# EAGLE design charger-sw (EAGLE 5.12)
PARTNO: MMBT3906LT1G
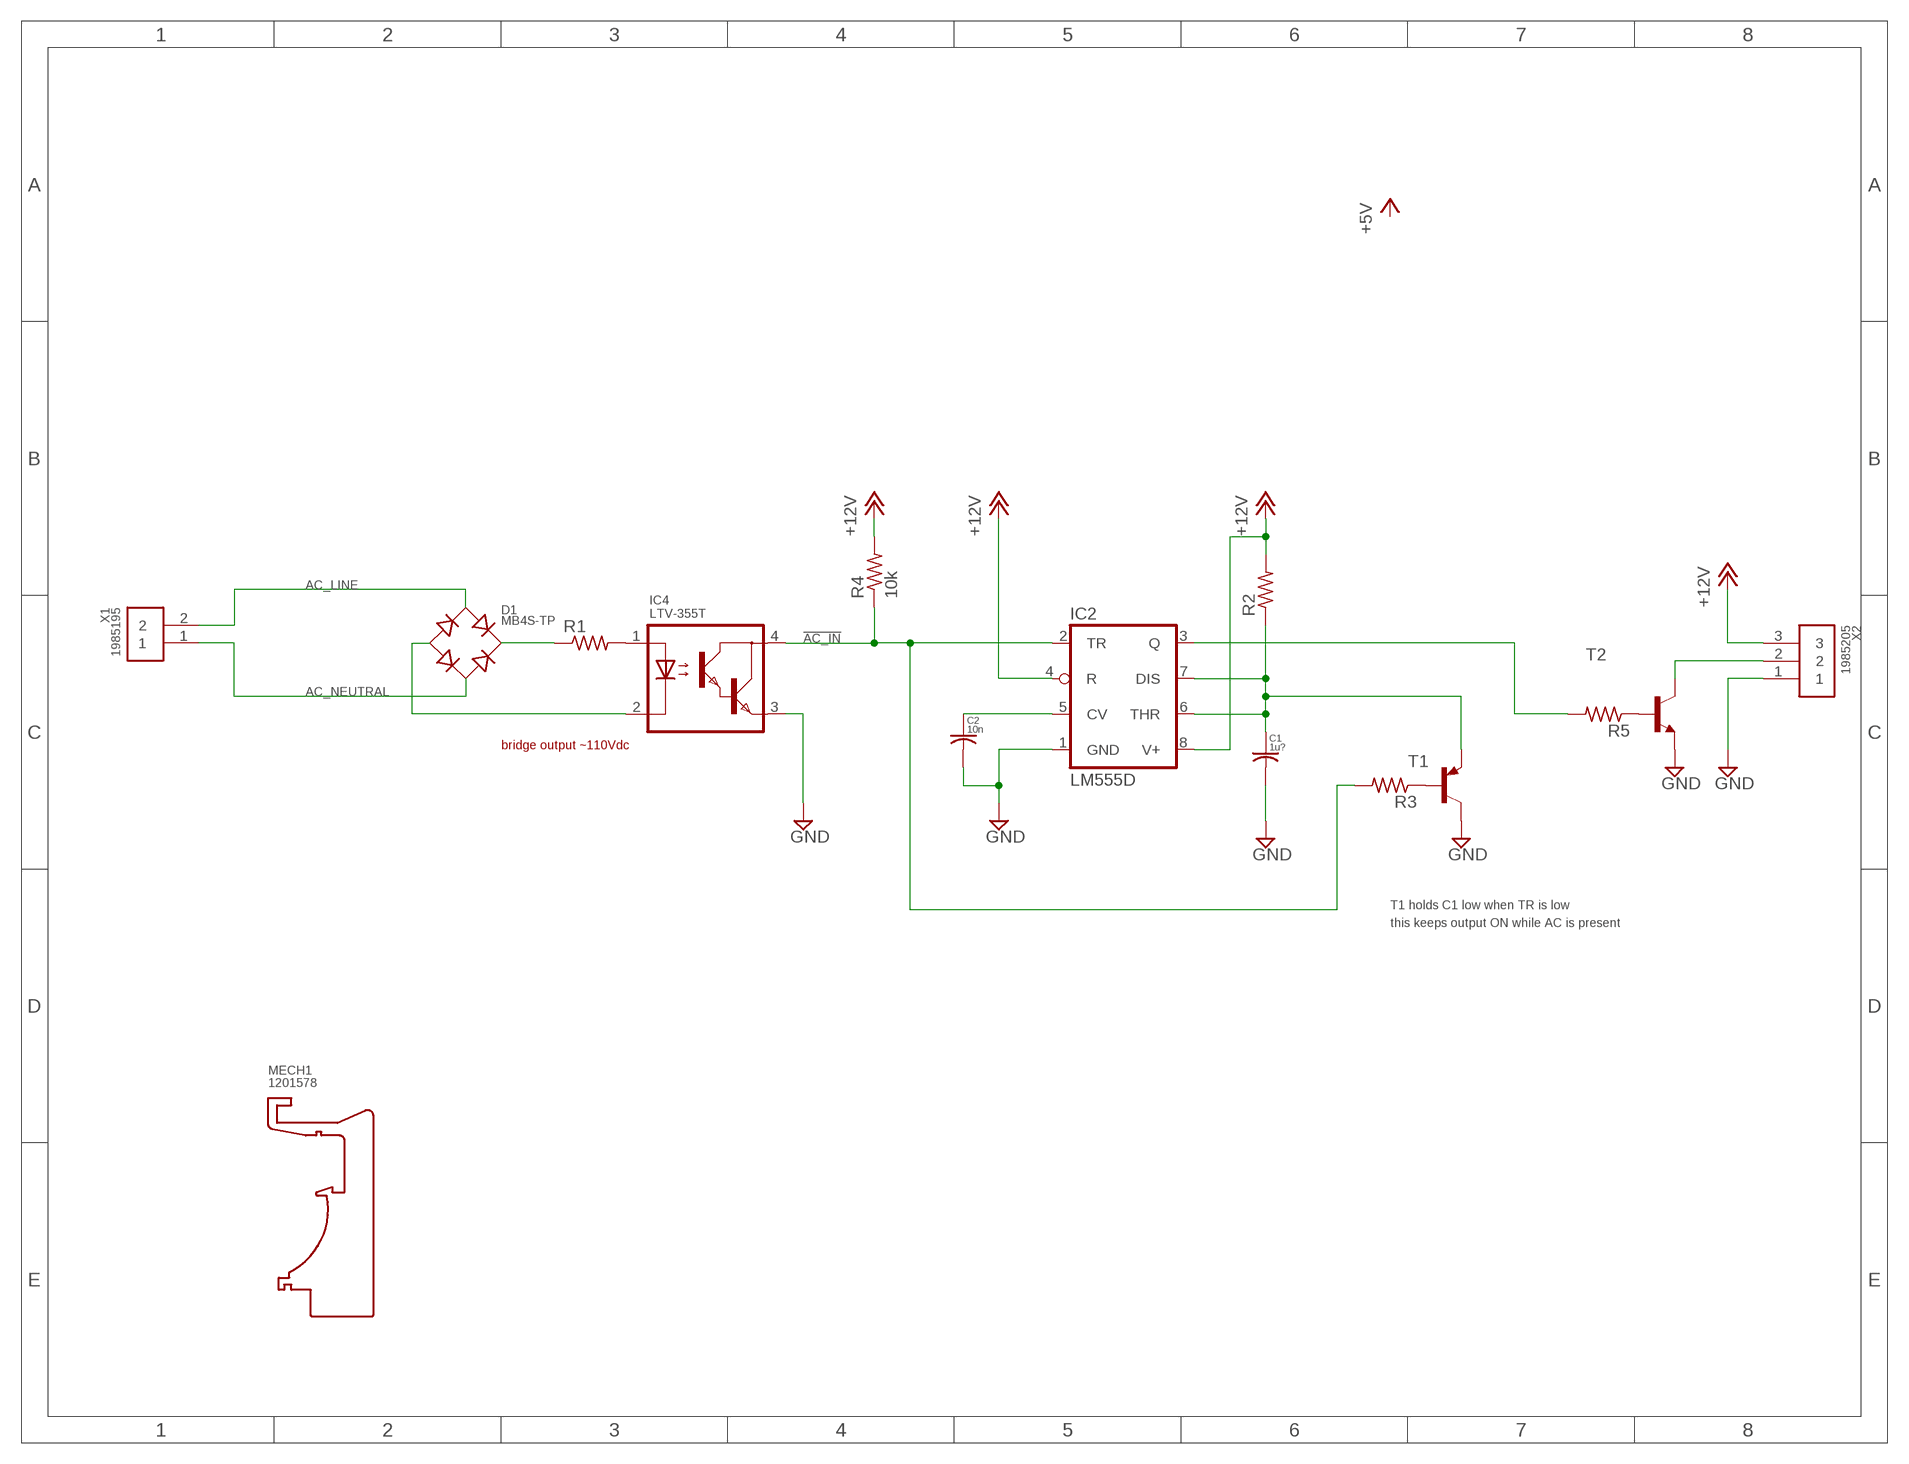
[diagram p0: schematic, sheet 1]

## Parts
C1  1u?  C-USC0603  [C0603]
C2  10n  C-USC0603  [C0603]
D1  MB4S-TP  [MB4S-TP]
IC2  LM555D  [SO08]
IC4  LTV-355T  [LTV-355T]
MECH1  DIN-RAIL-CLIP-2SCREW  [DIN-RAIL-CLIP-2SCREW]
R1  R-US_R0603  [R0603]
R2  R-US_R0603  [R0603]
R3  R-US_R0603  [R0603]
R4  10k  R-US_R0603  [R0603]
R5  R-US_R0603  [R0603]
T1  -PNP-SOT23-EBC  [SOT23-EBC]
T2  -NPN-SOT23-EBC  [SOT23-EBC]
X1  PHOENIX_1985195  [PHOENIX_1985195]
X2  PHOENIX_1985205  [PHOENIX_1985205]

## Nets
!AC_IN: IC2.2(TR) IC4.4(COLLECTOR) R3.2 R4.1
+12V: IC2.4(R) IC2.8(V+) R2.2 R4.2 X2.3
AC_LINE: D1.3(AC1) X1.2
AC_NEUTRAL: D1.4(AC2) X1.1
GND: C1.2 C2.2 IC2.1(GND) IC4.3(EMITTER) T1.C T2.E X2.1
N$1: IC4.1(ANODE) R1.2
N$2: D1.1(+) R1.1
N$3: D1.2(-) IC4.2(CATHODE)
N$4: R5.1 T2.B
N$5: IC2.3(Q) R5.2
N$6: T2.C X2.2
N$7: C1.1 IC2.6(THR) IC2.7(DIS) R2.1 T1.E
N$8: C2.1 IC2.5(CV)
N$11: R3.1 T1.B

## Notes on the sheet
- bridge output ~110Vdc
- T1 holds C1 low when TR is low
- this keeps output ON while AC is present

## Library data of the parts
C1 C2 = rcl:C-US: CAPACITOR, American symbol
D1 = charger-sw:MB4S-TP; PARTNO: MB4S-TP
IC2 = linear:*555: TIMER
IC4 = charger-sw:LTV-355T; PARTNO: LTV-355T
MECH1 = charger-sw:DIN-RAIL-CLIP; PARTNO: 1201578
R1-R5 = rcl:R-US_: RESISTOR, American symbol
T1 = transistor:*-PNP-: PNP Transistror
T2 = transistor:*-NPN-: NPN Transistror BF959 corrected 2008.03.06
X1 = charger-sw:PHOENIX_1985195; PARTNO: 1985195
X2 = charger-sw:PHOENIX_1985205; PARTNO: 1985205

## Board
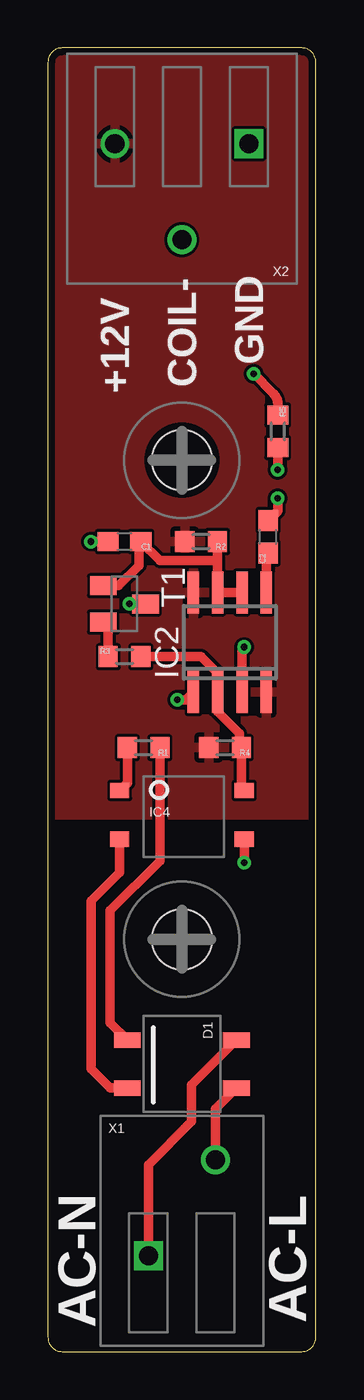
[diagram p1: board, top side]
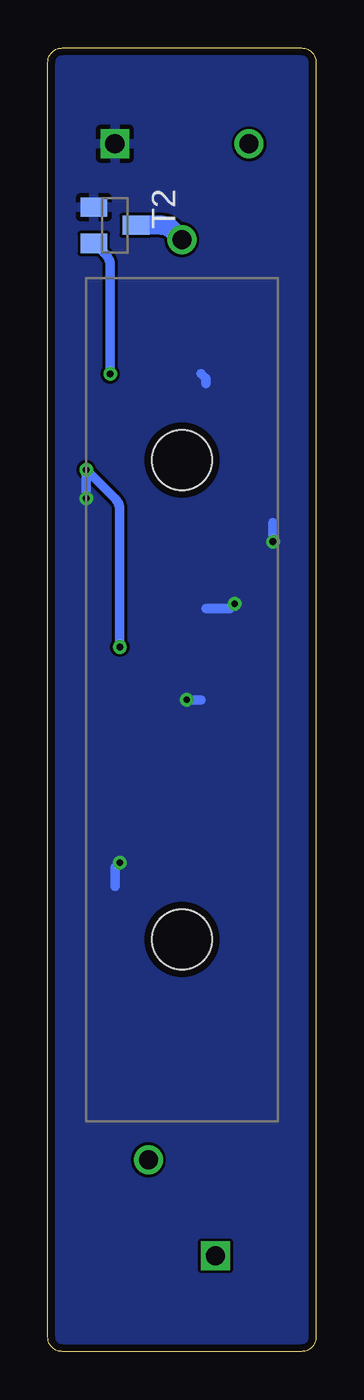
[diagram p2: board, bottom side, seen from below]

Size 14 x 68 mm. Coordinates in mm from the lower left corner, seen from the top.
Outline: 0,0.75 arc90 0.75,0 13.25,0 arc90 14,0.75 14,67.25 arc90 13.25,68 0.75,68 arc90 0,67.25 0,0.75
Copper layers (1*16): Top 0.0356mm / dielectric 1.5011mm / Bottom 0.0356mm
Design rules "OSH Park 2-layer": minimum track width 6mil, minimum drill 13mil, track to track 6mil, track to pad 6mil, pad to pad 6mil, via to via 6mil, smd to smd 6mil, copper to edge 15mil, drill to drill 6mil, minimum pad ring 7mil, minimum via ring 7mil, stop-mask expansion 4mil, vias tented up to drill 25mil, thermal gap 10mil

### Footprints (pad centres in the part's own frame; a part is rotated, then mirrored left to right if it is on the bottom)
C0603 = smd 1.1 x 1: 1 -0.85,0; 2 0.85,0
MB4S-TP = smd 0.8 x 1.4: 1 -1.25,-2.85; 2 1.25,-2.85; 3 1.25,2.85; 4 -1.25,2.85
SO08 = smd 0.6 x 2.2: 1 -1.905,-2.6; 2 -0.635,-2.6; 3 0.635,-2.6; 4 1.905,-2.6; 5 1.905,2.6; 6 0.635,2.6; 7 -0.635,2.6; 8 -1.905,2.6
LTV-355T = smd 0.8 x 1: 1 -1.27,-3.25; 2 1.27,-3.25; 3 1.27,3.25; 4 -1.27,3.25
DIN-RAIL-CLIP-2SCREW = hole 3.15: 0,12.5; 0,-12.5
R0603 = smd 1 x 1.1: 1 -0.85,0; 2 0.85,0
SOT23-EBC = smd 1 x 1.4: B 0.95,-1.1; C 0,1.1; E -0.95,-1.1
PHOENIX_1985195 = drill 1 square: 1 -1.75,0 | drill 1 round: 2 1.75,5
PHOENIX_1985205 = drill 1 square: 1 -3.5,0 | drill 1 round: 2 0,5; 3 3.5,0

### Placement (x,y rotation side)
C1  4,42.25 180 top
C2  11.5,42.5 90 top
D1  7,15 270 top
IC2  9.5,37 0 top
IC4  7,28 270 top
MECH1  7,34 0 top
R1  5,31.5 180 top
R2  8,42.25 180 top
R3  4,36.25 0 top
R4  9.25,31.5 180 top
R5  12,48 270 top
T1  4,39 270 top
T2  10.5,58.75 270 bottom
X1  7,5 0 top
X2  7,63 180 top

### Tracks (layer width: path | path; a pad name or v marks a point on that pad's centre or on a via)
!AC_IN
  Top 0.5: R3.2 8,36.25 8.87,35.39 IC2.2 8.87,33.39 10,32.25 10,31.6 R4.1 10.1,29.42 IC4.4
+12V
  pour Top: -2,71.25 17.25,71.25 17,28 -2.25,28
AC_LINE
  Top 0.5: X1.2 8.75,12.65 D1.3
AC_NEUTRAL
  Top 0.5: X1.1 5.25,9.75 7.5,12 7.5,13.9 D1.4
GND  (via drill 0.35)
  Top 0.5: v10.25,25.5 IC4.3 | IC2.1 7.2,34 v6.75,34 | T1.C v4.25,39 | v2.25,42.25 C1.2 | C2.2 12,43.85 v12,44.5
  Bottom 0.5: v10.25,25.5 10.5,25.25 10.5,24.25 | v6.75,34 6,34 | v4.25,39 4.5,38.75 5.75,38.75 | v2.25,42.25 2.25,43.25 | v12,44.5 12,45.75 | 6,51 5.75,50.75 5.75,50.5
  pour Bottom: -2,71.25 17.25,71.25 17.25,-2.25 -2,-2.25
N$1
  Top 0.5: IC4.1 4.15,29.67 R1.2
N$2
  Top 0.5: D1.1 3.25,17.15 3.25,23 5.85,25.6 R1.1
N$3
  Top 0.5: IC4.2 3.75,25 2.25,23.5 2.25,14.75 3.25,13.75 D1.2
N$4  (via drill 0.35)
  Top 0.5: R5.1 12,49.44 arc45 11.78,49.97 v10.75,51
  Bottom 0.5: v10.75,51 10.75,56.69 arc-45 10.97,57.22 11.5,57.75 arc45 11.59,57.78 T2.B
N$5  (via drill 0.35)
  Top 0.5: IC2.3 10.13,36.47 arc-45 v10.25,36.75 | v12,46 R5.2
  Bottom 0.5: v10.25,36.75 10.25,43.94 arc-45 10.47,44.47 v12,46
N$6
  Bottom 1: T2.C 8.06,58.75 arc45 7.53,58.53 X2.2
N$7
  Top 0.5: 8.85,41.25 8.85,39.61 IC2.7 IC2.6 | 8.85,41.25 R2.1 | T1.E 3.7,39.95 4.75,41 4.75,41.9 C1.1 5.85,41.25 8.85,41.25
N$8
  Top 0.5: C2.1 11.41,41.55 IC2.5
N$11
  Top 0.5: T1.B 3.15,37.8 R3.1

### Text on the board
tPlace: COIL- | GND | +12V | AC-L | AC-N